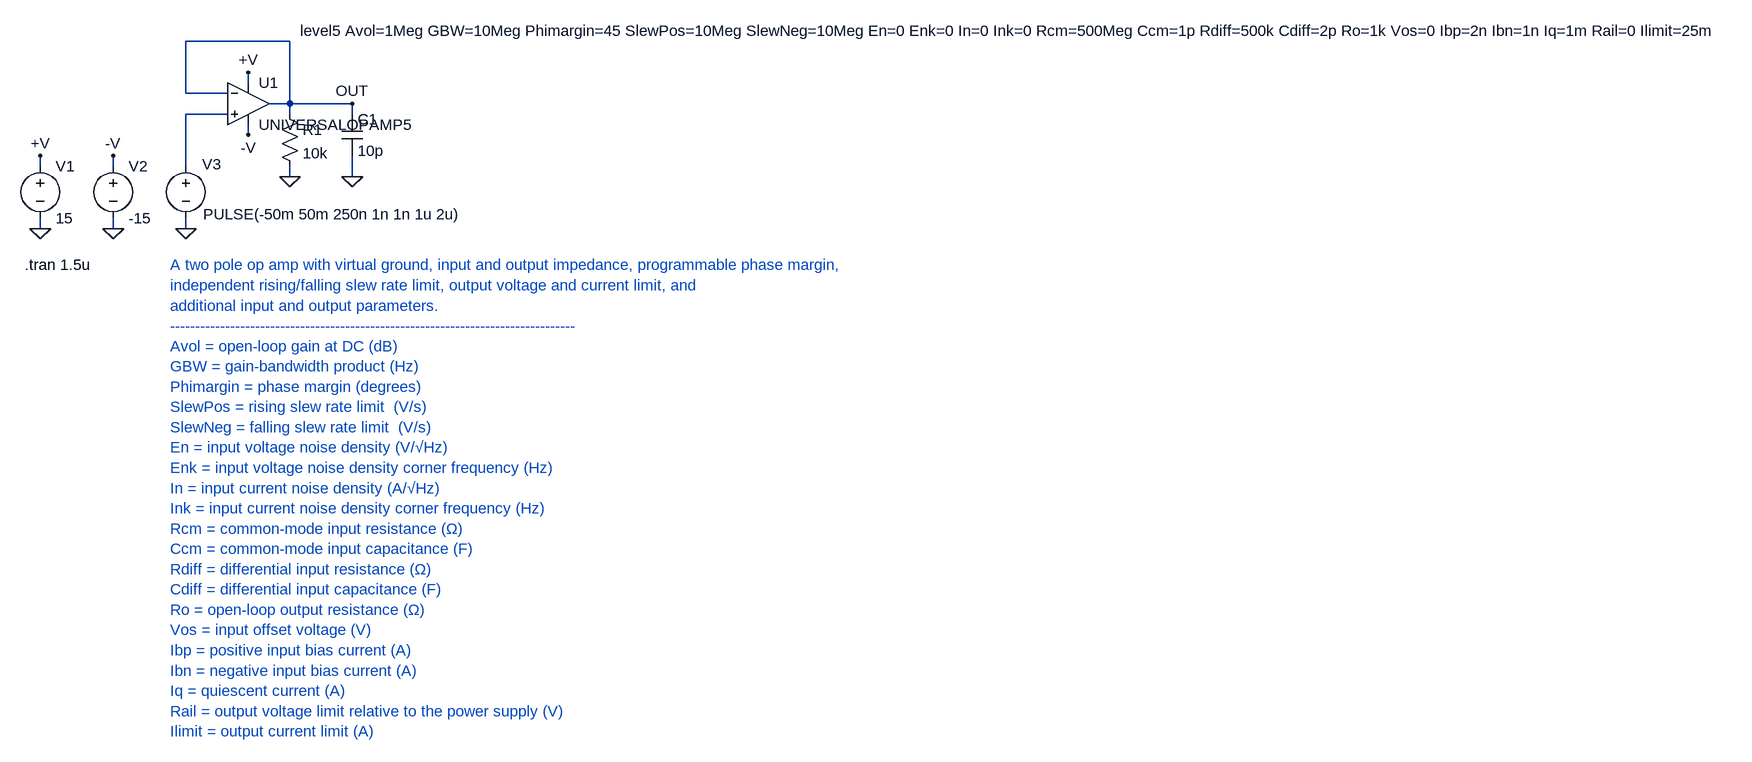
[diagram p0: schematic UniversalOpAmp5.asc]
UniversalOpAmp5.asc, the LTspice schematic file:
Version 4.1
SHEET 1 2580 1564
WIRE 560 560 400 560
WIRE 496 624 496 608
WIRE 400 640 400 560
WIRE 464 640 400 640
WIRE 560 656 560 560
WIRE 560 656 528 656
WIRE 656 656 560 656
WIRE 464 672 400 672
WIRE 560 672 560 656
WIRE 656 672 656 656
WIRE 496 704 496 688
WIRE 176 752 176 736
WIRE 288 752 288 736
WIRE 400 752 400 672
WIRE 560 768 560 752
WIRE 656 768 656 736
WIRE 176 848 176 832
WIRE 288 848 288 832
WIRE 400 848 400 832
FLAG 288 848 0
FLAG 176 848 0
FLAG 176 736 +V
FLAG 288 736 -V
FLAG 400 848 0
FLAG 496 704 -V
FLAG 496 608 +V
FLAG 656 768 0
FLAG 560 768 0
FLAG 656 656 OUT
SYMBOL voltage 176 736 R0
SYMATTR InstName V1
SYMATTR Value 15
SYMBOL voltage 288 736 R0
SYMATTR InstName V2
SYMATTR Value -15
SYMBOL voltage 400 736 R0
WINDOW 0 25 13 Left 2
WINDOW 3 27 90 Left 2
WINDOW 123 27 116 Left 2
WINDOW 39 0 0 Left 0
SYMATTR InstName V3
SYMATTR Value PULSE(-50m 50m 250n 1n 1n 1u 2u)
SYMBOL res 544 656 R0
SYMATTR InstName R1
SYMATTR Value 10k
SYMBOL cap 640 672 R0
SYMATTR InstName C1
SYMATTR Value 10p
SYMBOL UniversalOpAmp5 496 656 R0
WINDOW 123 80 -112 Left 2
WINDOW 39 80 -80 Left 2
WINDOW 40 80 -48 Left 2
SYMATTR InstName U1
TEXT 152 904 Left 2 !.tran 1.5u
TEXT 376 904 Left 2 ;A two pole op amp with virtual ground, input and output impedance, programmable phase margin,\nindependent rising/falling slew rate limit, output voltage and current limit, and\nadditional input and output parameters.\n---------------------------------------------------------------------------------\nAvol = open-loop gain at DC (dB)\nGBW = gain-bandwidth product (Hz)\nPhimargin = phase margin (degrees)\nSlewPos = rising slew rate limit  (V/s) \nSlewNeg = falling slew rate limit  (V/s) \nEn = input voltage noise density (V/√Hz)\nEnk = input voltage noise density corner frequency (Hz)\nIn = input current noise density (A/√Hz)\nInk = input current noise density corner frequency (Hz)\nRcm = common-mode input resistance (Ω)\nCcm = common-mode input capacitance (F)\nRdiff = differential input resistance (Ω)\nCdiff = differential input capacitance (F)\nRo = open-loop output resistance (Ω)\nVos = input offset voltage (V)\nIbp = positive input bias current (A)\nIbn = negative input bias current (A)\nIq = quiescent current (A)\nRail = output voltage limit relative to the power supply (V)\nIlimit = output current limit (A)

The netlist it stands for:
* UniversalOpAmp5.asc
V1 +V 0 15
V2 -V 0 -15
V3 N001 0 PULSE(-50m 50m 250n 1n 1n 1u 2u)
R1 OUT 0 10k
C1 OUT 0 10p
X§U1 N001 OUT +V -V OUT level5 Avol=1Meg GBW=10Meg Phimargin=45 SlewPos=10Meg SlewNeg=10Meg En=0 Enk=0 In=0 Ink=0 Rcm=500Meg Ccm=1p Rdiff=500k Cdiff=2p Ro=1k Vos=0 Ibp=2n Ibn=1n Iq=1m Rail=0 Ilimit=25m  ; UNIVERSALOPAMP5, pins In+ In- V+ V- OUT
.tran 1.5u
* A two pole op amp with virtual ground, input and output impedance, programmable phase margin,
* independent rising/falling slew rate limit, output voltage and current limit, and
* additional input and output parameters.
* ---------------------------------------------------------------------------------
* Avol = open-loop gain at DC (dB)
* GBW = gain-bandwidth product (Hz)
* Phimargin = phase margin (degrees)
* SlewPos = rising slew rate limit  (V/s)
* SlewNeg = falling slew rate limit  (V/s)
* En = input voltage noise density (V/√Hz)
* Enk = input voltage noise density corner frequency (Hz)
* In = input current noise density (A/√Hz)
* Ink = input current noise density corner frequency (Hz)
* Rcm = common-mode input resistance (Ω)
* Ccm = common-mode input capacitance (F)
* Rdiff = differential input resistance (Ω)
* Cdiff = differential input capacitance (F)
* Ro = open-loop output resistance (Ω)
* Vos = input offset voltage (V)
* Ibp = positive input bias current (A)
* Ibn = negative input bias current (A)
* Iq = quiescent current (A)
* Rail = output voltage limit relative to the power supply (V)
* Ilimit = output current limit (A)
.backanno
.end